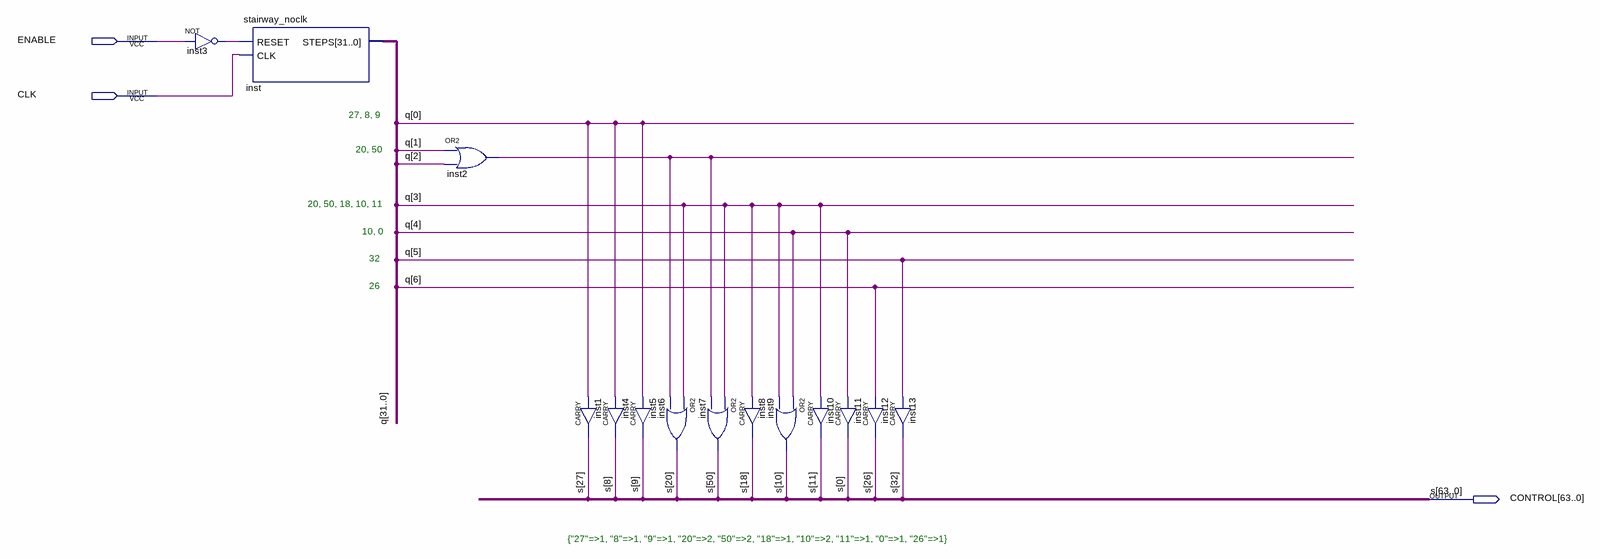
[diagram p0: schematic sheet]
// Quartus schematic macro_jmp.bdf as structural Verilog: 14 symbols, 3 pins
module macro_jmp (
  input  ENABLE,
  input  CLK,
  output [63:0] CONTROL
);

  wire inst2_out, inst3_out;
  wire [31:0] q;

  not inst3 (inst3_out, ENABLE);
  stairway_noclk inst (.RESET(inst3_out), .CLK(CLK), .STEPS(q));
  or inst2 (inst2_out, q[1], q[2]);
  CARRY inst1 (.IN(q[0]), .OUT(CONTROL[27]));
  CARRY inst4 (.IN(q[0]), .OUT(CONTROL[8]));
  CARRY inst5 (.IN(q[0]), .OUT(CONTROL[9]));
  or inst6 (CONTROL[20], q[3], inst2_out);
  or inst7 (CONTROL[50], q[3], inst2_out);
  CARRY inst8 (.IN(q[3]), .OUT(CONTROL[18]));
  or inst9 (CONTROL[10], q[4], q[3]);
  CARRY inst10 (.IN(q[3]), .OUT(CONTROL[11]));
  CARRY inst11 (.IN(q[4]), .OUT(CONTROL[0]));
  CARRY inst12 (.IN(q[6]), .OUT(CONTROL[26]));
  CARRY inst13 (.IN(q[5]), .OUT(CONTROL[32]));

  // Other names for the same wires on the sheet: s[63:0] = CONTROL

  // Notes on the sheet:
  //   27, 8, 9
  //   20, 50
  //   20, 50, 18, 10, 11
  //   10, 0
  //   32
  //   26
  //   {"27"=>1, "8"=>1, "9"=>1, "20"=>2, "50"=>2, "18"=>1, "10"=>2, "11"=>1, "0"=>1, "26"=>1}
endmodule
